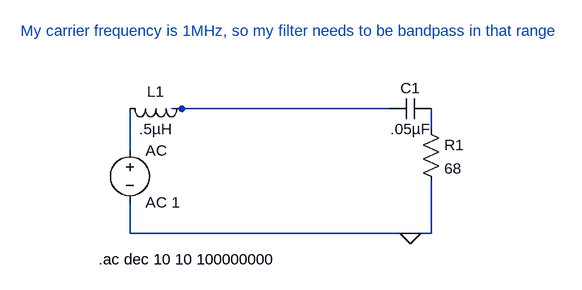
[diagram p0: schematic reciever_RLC_filter.asc]
reciever_RLC_filter.asc, the LTspice schematic file:
Version 4
SHEET 1 880 680
WIRE 0 0 -16 0
WIRE 320 0 0 0
WIRE 384 32 384 0
WIRE -80 64 -80 0
WIRE -80 192 -80 144
WIRE 352 192 -80 192
WIRE 384 192 384 112
WIRE 384 192 352 192
FLAG 352 192 0
SYMBOL voltage -80 48 R0
WINDOW 123 0 0 Left 0
WINDOW 39 0 0 Left 0
SYMATTR InstName AC
SYMATTR Value AC 1
SYMBOL res 368 16 R0
SYMATTR InstName R1
SYMATTR Value 68
SYMBOL ind 16 -16 R90
WINDOW 0 5 56 VBottom 2
WINDOW 3 32 56 VTop 2
SYMATTR InstName L1
SYMATTR Value .5µH
SYMBOL cap 384 -16 R90
WINDOW 0 0 32 VBottom 2
WINDOW 3 32 32 VTop 2
SYMATTR InstName C1
SYMATTR Value .05µF
TEXT -248 -120 Left 2 ;My carrier frequency is 1MHz, so my filter needs to be bandpass in that range
TEXT -128 232 Left 2 !.ac dec 10 10 100000000

The netlist it stands for:
* reciever_RLC_filter.asc
V§AC N003 0 AC 1
R1 N002 0 68
L1 N001 N003 .5µH
C1 N002 N001 .05µF
* My carrier frequency is 1MHz, so my filter needs to be bandpass in that range
.ac dec 10 10 100000000
.backanno
.end